# Altium schematic sheet mainsheet.SchDoc: Processor Section
size A4; Author: Marcel Hellwig; Organization: Hamburg Bit-Bots; Address1: Vogt-Kölln-Str. 30; Address2: 22527 Hamburg; Address3: Germany; Address4: www.bit-bots.de; DocumentNumber: 1; SheetNumber: 1; SheetTotal: 4; EMail: info@bit-bots.de
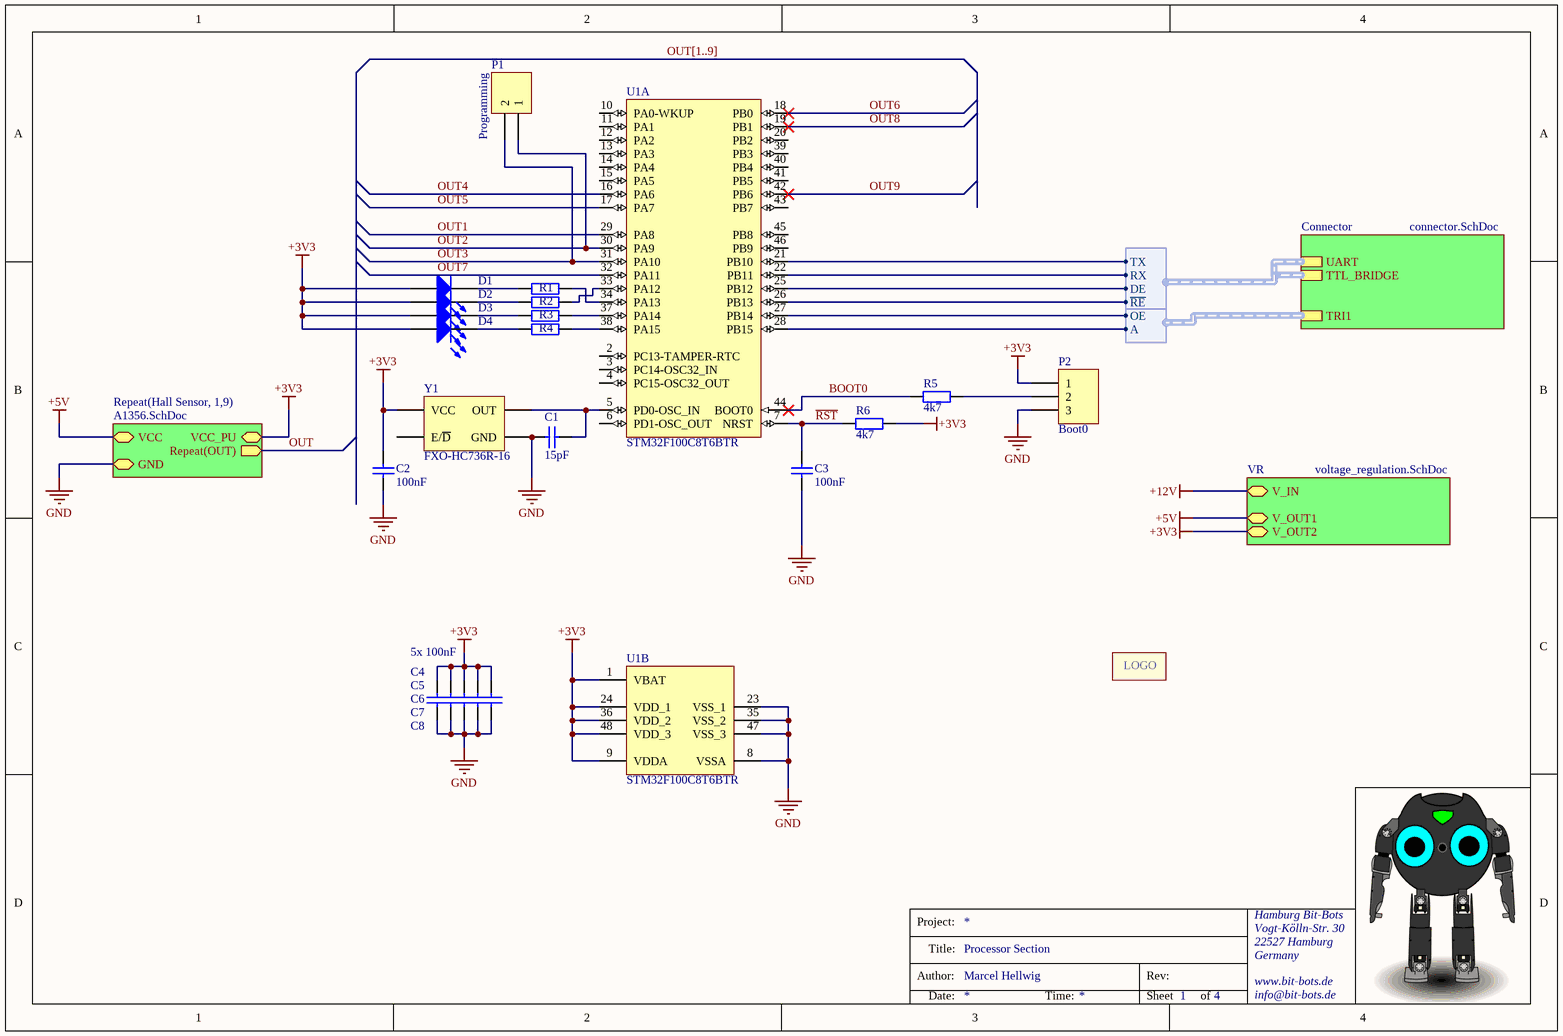
[diagram p0: mainsheet.SchDoc]

## Parts
C1  15pF  [C2012]
C2  100nF  [C2012]
C3  100nF  [C2012]
C4  100nF  [C2012]  (value not drawn)
C5  100nF  [C2012]  (value not drawn)
C6  100nF  [C2012]  (value not drawn)
C7  100nF  [C2012]  (value not drawn)
C8  100nF  [C2012]  (value not drawn)
D1  Green  [MLCC2]  (value not drawn)
D2  Green  [MLCC2]  (value not drawn)
D3  Green  [MLCC2]  (value not drawn)
D4  Green  [MLCC2]  (value not drawn)
Logo1  Hamburg Bit-Bots Logo  [Logo]  (value not drawn)  (no BOM)
P1  Programming  [HDR1X2]  (no BOM)
P2  Boot0  [HDR1X3]  (no BOM)
R1  1k  [R2012]  (value not drawn)
R2  1k  [R2012]  (value not drawn)
R3  1k  [R2012]  (value not drawn)
R4  1k  [R2012]  (value not drawn)
R5  4k7  [R2012]
R6  4k7  [R2012]
U1  STM32F100C8T6BTR  [STM-LQFP48_L]  (parts A,B of 2)
Y1  FXO-HC736R-16  [FXO-HC73]

## Sub-sheets
Connector = connector.SchDoc: UART (harness UART), TTL_BRIDGE (harness UART), TRI1 (harness Tri-State)
Repeat(Hall Sensor, 1,9) = A1356.SchDoc: VCC, GND, Repeat(OUT) (out), VCC_PU
VR = voltage_regulation.SchDoc: V_OUT1, V_OUT2, V_IN

## Harnesses
Tri-State: A, OE
UART: ~{RE}, DE, RX, TX

## Nets
+3V3: C2.1 C4.2 C5.2 C6.2 C7.2 C8.2 D1.1(A) D2.1(A) D3.1(A) D4.1(A) P2.1 R6.2 U1.1(VBAT) U1.9(VDDA) U1.24(VDD_1) U1.36(VDD_2) U1.48(VDD_3) Y1.4(VCC) ; sheet Repeat(Hall Sensor, 1,9)/VCC_PU, sheet VR/V_OUT2
+5V: sheet Repeat(Hall Sensor, 1,9)/VCC, sheet VR/V_OUT1
+12V: sheet VR/V_IN
GND: C1.1 C2.2 C3.1 C4.1 C5.1 C6.1 C7.1 C8.1 P2.3 U1.8(VSSA) U1.23(VSS_1) U1.35(VSS_2) U1.47(VSS_3) Y1.2(GND) ; sheet Repeat(Hall Sensor, 1,9)/GND
~{RST}: C3.2 R6.1 U1.7(NRST)
BOOT0: R5.1 U1.44(BOOT0)
OUT: sheet Repeat(Hall Sensor, 1,9)/Repeat(OUT)
OUT1: U1.29(PA8)
OUT2: P1.1 U1.30(PA9)
OUT3: P1.2 U1.31(PA10)
OUT4: U1.16(PA6)
OUT5: U1.17(PA7)
OUT6: U1.18(PB0)
OUT7: U1.32(PA11)
OUT8: U1.19(PB1)
OUT9: U1.42(PB6)
NetC1_2: C1.2 U1.5(PD0-OSC_IN) Y1.3(OUT)
NetD1_2: D1.2(K) R1.2
NetD2_2: D2.2(K) R2.2
NetD3_2: D3.2(K) R3.2
NetD4_2: D4.2(K) R4.2
NetP2_2: P2.2 R5.2
NetR1_1: R1.1 U1.34(PA13)
NetR2_1: R2.1 U1.33(PA12)
NetR3_1: R3.1 U1.37(PA14)
NetR4_1: R4.1 U1.38(PA15)
NetU1_21: U1.21(PB10) ; sheet Connector/UART.TX
NetU1_22: U1.22(PB11) ; sheet Connector/UART.RX
NetU1_25: U1.25(PB12) ; sheet Connector/UART.DE
NetU1_26: U1.26(PB13) ; sheet Connector/UART.~{RE}
NetU1_27: U1.27(PB14) ; sheet Connector/TRI1.OE
NetU1_28: U1.28(PB15) ; sheet Connector/TRI1.A

Not connected (* = marked no-connect by the designer): U1 2(PC13-TAMPER-RTC) 3(PC14-OSC32_IN) 4(PC15-OSC32_OUT) 6(PD1-OSC_OUT) 10(PA0-WKUP) 11(PA1) 12(PA2) 13(PA3) 14(PA4) 15(PA5) 20(PB2) 39(PB3) 40(PB4) 41(PB5) 43(PB7) 45(PB8) 46(PB9); Y1 1(E/~{D})

## Buses and harness runs
bus OUT[1..9]
harness sheet Connector/TTL_BRIDGE = sheet Connector/UART

## Notes on the sheet
- 5x 100nF
- Project:
- Author:
- Title:
- Rev:
- Date:
- Time:
- Sheet
- of
- (in symbol Logo) LOGO

## Library data of the parts
C1 = Cap: Capacitor; Manufacturer: MULTICOMP; Manufacturer Part Number: MC0805N150J500CT; Produktpalette: Baureihe MC; Kapazität: 15; Kapazitätstoleranz: ±5%; Dielektrikum: C0G / NP0; Nennspannung: 50; Keramikkondensatorgehäuse: 0805 [Metrisch 2012]; Betriebstemperatur, min.: -55; Betriebstemperatur, max.: 125; Verpackung: Gurtabschnitt; SVHC: No SVHC (17-Dec-2014); Betriebstemperatur: -55°C bis +125; Kondensatoranschlüsse: SMD<!--FANDB--><div class="features-and-benefits-container"></div>; Published: 8-Jun-2000; LatestRevisionDate: 17-Jul-2002; LatestRevisionNote: Re-released for DXP Platform.; PackageReference: RAD-0.3; Publisher: Altium Limited; PackageDescription: Radial Cap, Thru-Hole; 2 Leads; 0.3 in Pin Spacing; Value: 15pF; Supplier 1: Farnell; Supplier Part Number 1: 1759193; RoHS: YES; Stock 1: 38433; Pricing 1: 10=0,021, 100=0,017, 500=0,014, 1000=0,012, 2000=0,009 (EUR); MSL: -; Bauform: 0805 [Metrisch 2012]; Kapazitätstoleranz ±: ±5%; ComponentLink1URL: http://www.farnell.com/datasheets/1870456.pdf; ComponentLink1Description: http://www.farnell.com/datasheets/1870456.pdf
C2-C8 = Cap: Capacitor; Published: 8-Jun-2000; LatestRevisionDate: 17-Jul-2002; LatestRevisionNote: Re-released for DXP Platform.; PackageReference: RAD-0.3; Publisher: Altium Limited; PackageDescription: Radial Cap, Thru-Hole; 2 Leads; 0.3 in Pin Spacing; Value: 100nF
  C2: Supplier 1: Farnell; Supplier Part Number 1: 1759265
D1-D4 = LED0: Typical INFRARED GaAs LED; Manufacturer: VISHAY; Manufacturer Part Number: VLMC3100-GS08; Leuchtengröße: 2.4; LED-Farbe: Grün; Lichtstärke: 1.6; Abstrahlwinkel: 120°; Durchlassstrom If: 2; Durchlassspannung: 1.9; LED-Montage: Oberflächenmontage; Linsenform: Rund; Wellenlänge, typ.: 575; Verpackung: Gurtabschnitt; SVHC: No SVHC (16-Jun-2014); Betriebstemperatur: -40°C bis +100; Betriebstemperatur, max.: 100; Betriebstemperatur, min.: -40; LED-Typ: Standard; LED/Lampen Größe: PLCC-2; Montage: SMD; Sperrspannung: 6; Spitzenwellenlänge: 565; Winkel halber Empfindlichkeit ±: 60; Published: 8-Jun-2000; LatestRevisionDate: 08-Jul-2005; LatestRevisionNote: Mech Layer 1 removed.; PackageReference: LED-0; Publisher: Altium Limited; PackageDescription: LED; 2 Leads; Supplier 1: Farnell; Supplier Part Number 1: 1659076; RoHS: YES; Stock 1: 12975; Pricing 1: 5=0,105, 25=0,0998, 100=0,0952, 250=0,0917, 500=0,0865, 2000=0,0771, 4000=0,0717, 20000=0,0689 (EUR); MSL: MSL 2A - 4 Wochen; Anzahl der Pins: 2; Dominante Wellenlänge: 575; Durchlassspannung Vf max.: 2.4; Durchlassstrom If, max.: 2; Lichtstärke, typ.: 1.6; ComponentLink1URL: http://www.farnell.com/datasheets/1698102.pdf; ComponentLink1Description: http://www.farnell.com/datasheets/1698102.pdf
Logo1 = Logo
P1 = Header 2: Header, 2-Pin; LatestRevisionDate: 17-Jul-2002; LatestRevisionNote: Re-released for DXP Platform.; Publisher: Altium Limited
P2 = Header 3: Header, 3-Pin; LatestRevisionDate: 17-Jul-2002; LatestRevisionNote: Re-released for DXP Platform.; Publisher: Altium Limited
R1-R4 = Res2: Resistor; Manufacturer: MULTICOMP; Manufacturer Part Number: MC01W0805110K; Published: 8-Jun-2000; LatestRevisionDate: 17-Jul-2002; LatestRevisionNote: Re-released for DXP Platform.; PackageReference: AXIAL-0.4; Publisher: Altium Limited; PackageDescription: Axial Device, Thru-Hole; 2 Leads; 0.4 in Pin Spacing; Value: 1k; Supplier 1: Farnell; Supplier Part Number 1: 9332391; RoHS: Y-EX; Stock 1: 4370; Pricing 1: 50=0,038, 250=0,031, 1000=0,022, 5000=0,014, 15000=0,009 (EUR); ComponentLink1URL: http://www.farnell.com/datasheets/1729047.pdf; ComponentLink1Description: http://www.farnell.com/datasheets/1729047.pdf; ComponentLink2URL: http://www.farnell.com/cad/1561156.zip; ComponentLink2Description: http://www.farnell.com/cad/1561156.zip
R5 R6 = Res2: Resistor; Published: 8-Jun-2000; LatestRevisionDate: 17-Jul-2002; LatestRevisionNote: Re-released for DXP Platform.; PackageReference: AXIAL-0.4; Publisher: Altium Limited; PackageDescription: Axial Device, Thru-Hole; 2 Leads; 0.4 in Pin Spacing; Value: 4k7
U1 = CMP-0237-00141-3: ARM Cortex-M3 32-bit MCU, 64 KB Flash, 8 KB Internal RAM, 37 I/Os, 48-pin LQFP, -40 to 85 degC, Tape and Reel; D/A Converter: 2x12-bit (2 Channel); I/Os (High Current): 37; A/D Converter: 1x12-bit (10 Channel); FLASH Size (Prog) (kB): 64; Operating Frequency(F) (Processor speed) (MHz): 24; Internal RAM Size (kB): 8; Supply Voltage(Vcc) min (V): 2; ComponentLink2Description: Datasheet; ComponentLink3Description: Package Specification; Packing: Tape and Reel; Core: ARM Cortex-M3; DatasheetVersion: Rev. 7; Mounting Technology: Surface Mount; ComponentLink3URL: http://www.st.com/st-web-ui/static/active/en/resource/technical/document/datasheet/DM00058181.pdf; PackageVersion: Rev. 6, 06/2013; PackageReference: LQFP48; ComponentLink1Description: Manufacturer URL; PartNumber: STM32F100C8T6BTR; ComponentLink1URL: http://www.st.com/web/en/home.html; PackageDescription: 48-Pin Low Profile Quad Flat Package, 7 x 7 mm Body, 0.5 mm Pitch; ComponentLink2URL: http://www.st.com/st-web-ui/static/active/en/resource/technical/document/datasheet/CD00251732.pdf; PartId: 1
Y1 = Oszillator: Oscillator with Enable Input; Supplier 1: Farnell; Supplier Part Number 1: 1640997